# Altium project Test_Jig_Project.PrjPcb
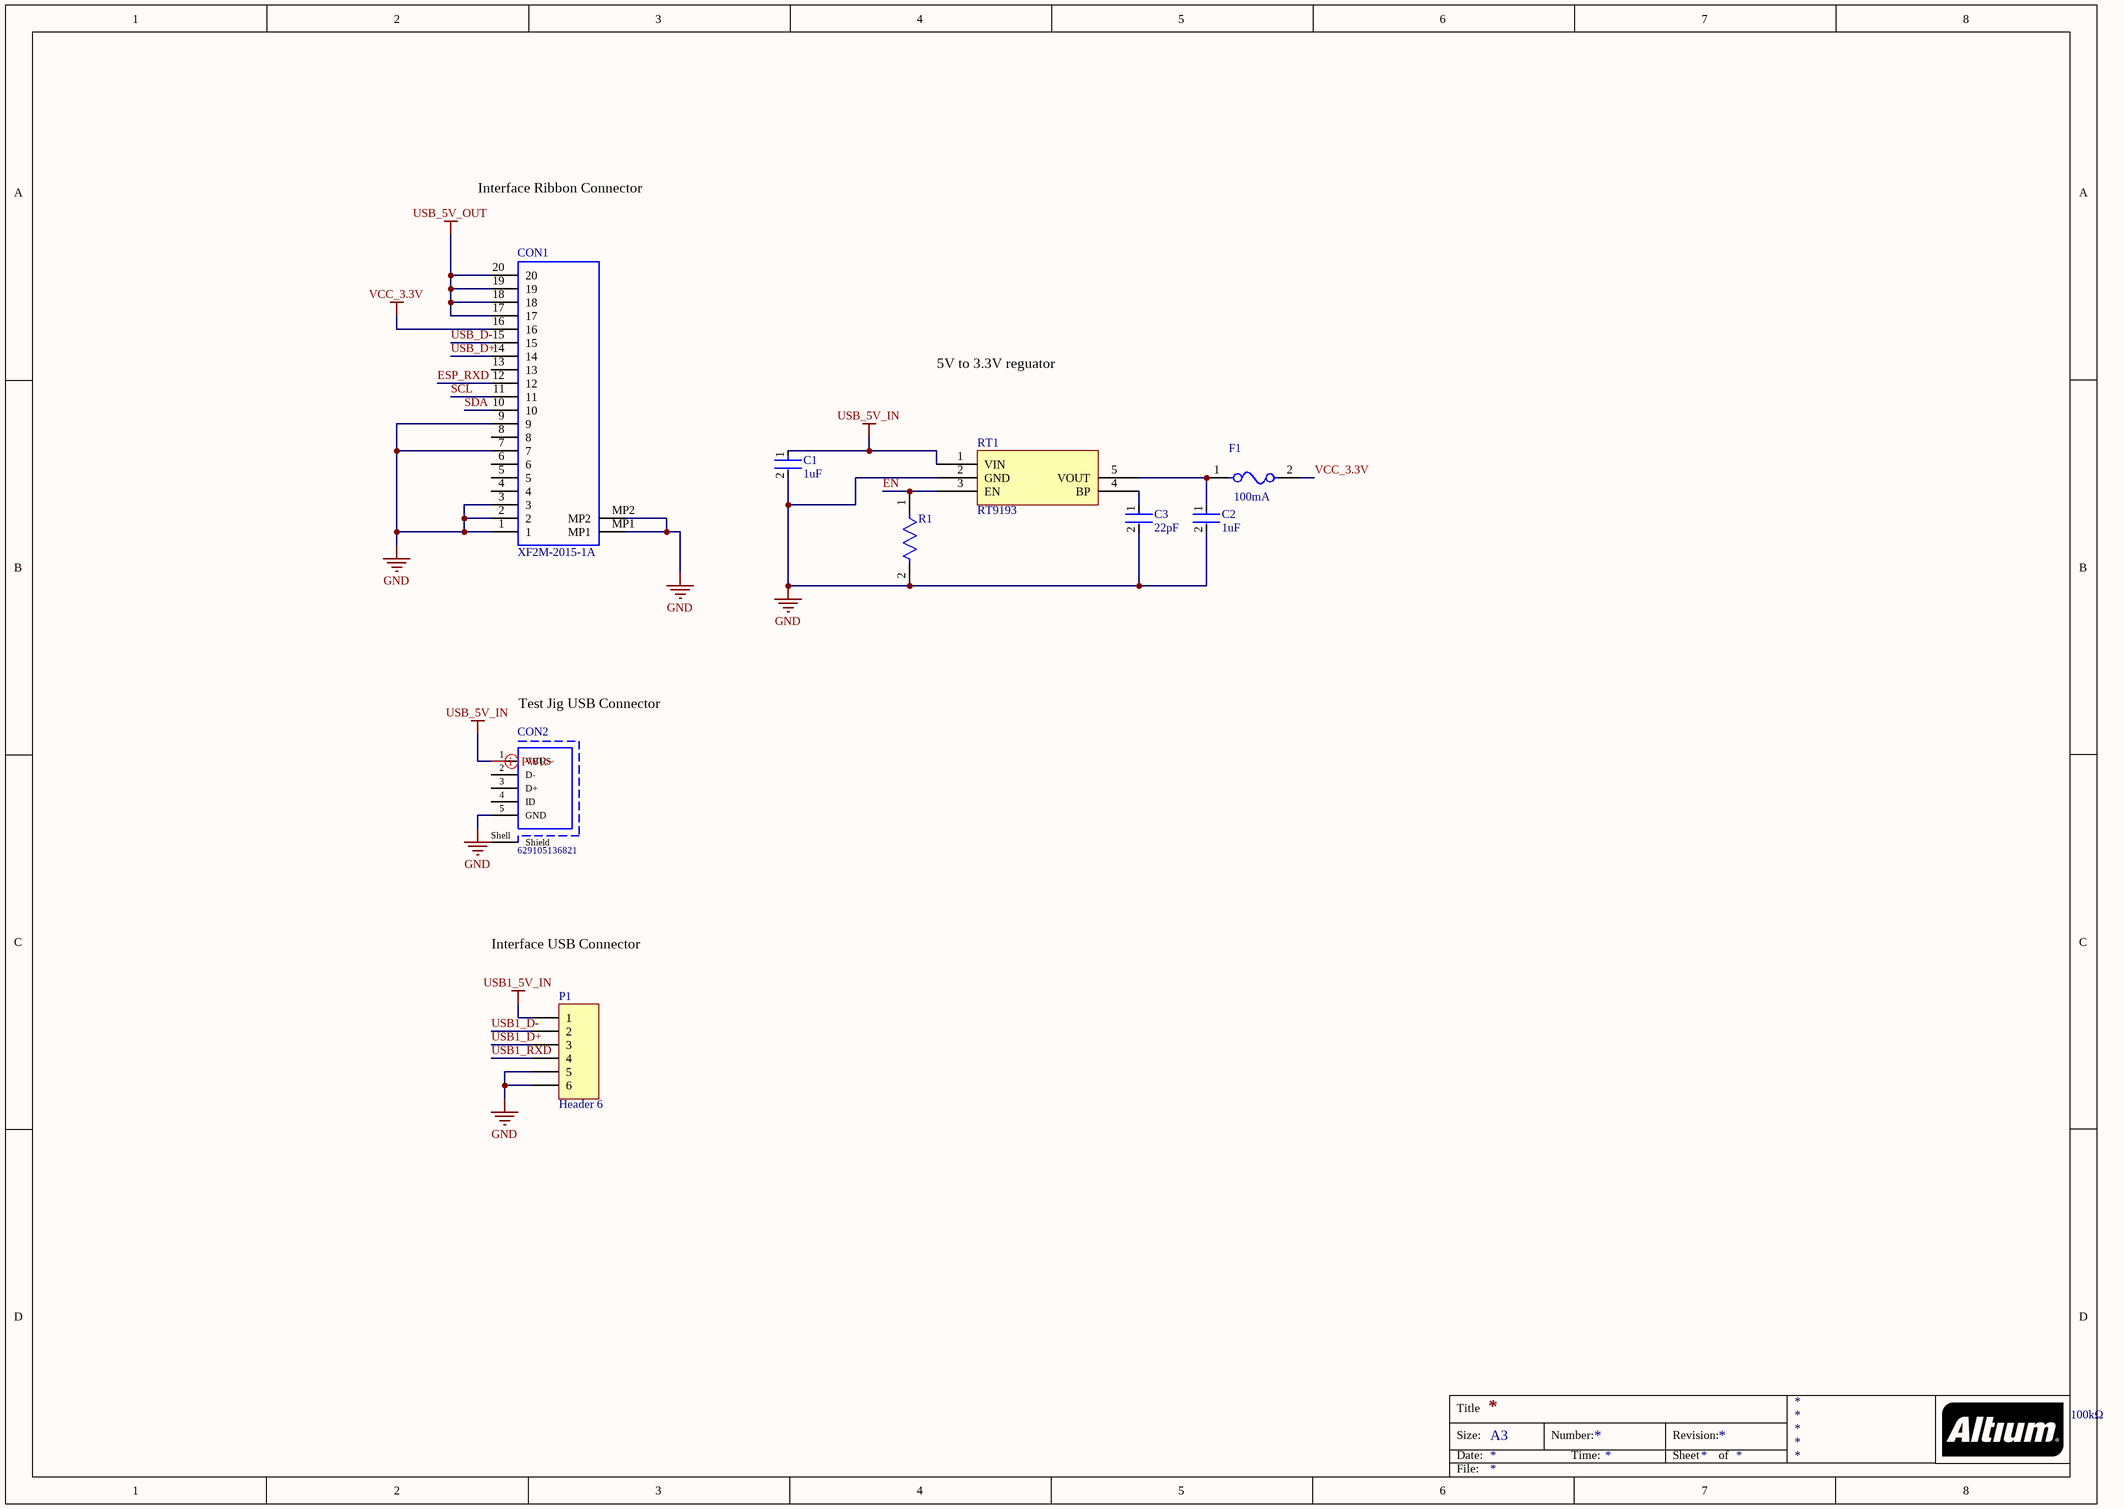
[diagram p0: Test_Jig_Project.SchDoc]
3 sheets, 47 parts. Net scope: global (net labels, ports and power ports of the same name join across sheets).
Board file: Test_Jig_Project1.PcbDoc
Sheets:
  Test_Jig_Project.SchDoc
  Relay connected.SchDoc
  ESP32.SchDoc

## Sheet Test_Jig_Project.SchDoc
size A3

### Parts
C1  1uF  [FP-CC0805-0_85-MFG]
C2  1uF  [FP-CC0805-0_85-MFG]
C3  22pF  [FP-C0402-BB-MFG]
CON1  XF2M-2015-1A  [XF2M20151A]
CON2  629105136821  [629105136821]
F1  100mA  [FP-MF-PSMF-MFG]
P1  Header 6  [HDR1X6]
R1  100kΩ  [FP-CRCW0402-e3-IPC_C]
RT1  RT9193  [SOT85P279X130-5N]

### Nets
GND: C1.2 C2.2 C3.2 CON1.1 CON1.2 CON1.3 CON1.7 CON1.9 CON1.MP1 CON1.MP2 CON2.5(GND) P1.5 P1.6 R1.2 RT1.2(GND)
USB1_5V_IN: P1.1
USB_5V_IN: C1.1 CON2.1(VBUS) RT1.1(VIN)
USB_5V_OUT: CON1.17 CON1.18 CON1.19 CON1.20
VCC_3.3V: CON1.16 F1.2
EN: R1.1 RT1.3(EN)
ESP_RXD: CON1.12
SCL: CON1.11
SDA: CON1.10
USB1_D+: P1.3
USB1_D-: P1.2
USB1_RXD: P1.4
USB_D+: CON1.14
USB_D-: CON1.15
NetC2_1: C2.1 F1.1 RT1.5(VOUT)
NetC3_1: C3.1 RT1.4(BP)

Not connected (* = marked no-connect by the designer): CON1 4 5 6 8 13; CON2 2(D-) 3(D+) 4(ID) Shell(Shield)

### Layout directives
rule Width Constraint [Pref Width = 12mil    Min Width = 6mil    Max Width = 12mil]: USB_5V_IN

### Notes on the sheet
- Interface Ribbon Connector
- 5V to 3.3V reguator
- (near CON2) Test Jig USB Connector
- Interface USB Connector
- Manufacturer
- Title
- Size:
- Date:
- A3
- Number:
- Time:
- Revision:
- Sheet
- of
- File:

### Library data of the parts
C1 C2 = CMP-03422-000182-1: CAP CER 1UF 10V X7R 0805; Manufacturer: Yageo; Mfr. Part #: CC0805KKX7R6BB105; Material: Ceramic; Tolerance: 0.1; Value: 1 uF; ComponentLink2URL: http://www.yageo.com/documents/recent/UPY-GPHC_Y5V_6.3V-to-50V_8.pdf; Automotive: No; Temperature Range Low: -30°C; Octopart: https://octopart.com/cc0805kkx7r6bb105-yageo-42522859; Temperature Characteristic: X7R; RoHS: TRUE; Voltage Rating: 10 V; Capacitance: 1 uF; Package: CC0805-0.85; Device Class L3: Ceramic Capacitors; Category: Cap; Mouser Description: Multilayer Ceramic Capacitors MLCC - SMD/SMT 1.0uF 10V X7R 10%; Temperature Range High: +85°C; Ipc Land Pattern Name: CAPC200125X85; ComponentLink2Description: Datasheet; Temperature: -30°C to +85°C; Height: 0.95mm; Lead Free: Yes; Device Class L1: Passive Components; Device Class L2: Capacitors; Footprint Url: http://www.yageo.com/exep/pages/download/literatures/UPY-C_GEN_24.pdf; Digikey Description: CAP CER 1UF 10V X7R 0805
C3 = CMP-1034-00897-3: CAP CER 22PF 10V NP0 0402; Mfr. Part #: C0402C220K8GACTU; Manufacturer: Kemet; Temperature Coefficient: 15%; Tolerance: 0.1; Temperature Characteristic: C0G; Material: Ceramic; Ipc Land Pattern Name: CAPC10050X50; Mouser Description: Multilayer Ceramic Capacitors MLCC - SMD/SMT 10volts 22pF C0G 10%; Temperature Range High: +125°C; Voltage Rating: 10 V; ComponentLink2Description: Datasheet; Digikey Description: CAP CER 22PF 10V NP0 0402; Device Class L1: Passive Components; Category: Cap; Temperature: -55°C to +125°C; Temperature Range Low: -55°C; ComponentLink2URL: https://content.kemet.com/datasheets/KEM_C1002_X7R_SMD.pdf; Automotive: No; Package: C0402-BB; RoHS: TRUE; Device Class L3: Ceramic Capacitors; Value: 22 pF; Height: 0.55mm; Octopart: https://octopart.com/c0402c220k8gactu-kemet-12592189; Capacitance: 22 pF; Lead Free: Yes; Device Class L2: Capacitors
CON1 = XF2M-2015-1A: OMRON - XF2M-2015-1A - FFC / FPC Board Connector, 0.5 mm, 20 Contacts, Receptacle, XF Series, Surface Mount, Top, Bottom; Manufacturer: Omron Electronics; Geometry.Height: 3.2mm; Mfr. Part #: XF2M-2015-1A; Mouser Part Number: 653-XF2M-2015-1A; Mouser Price/Stock: https://www.mouser.co.uk/ProductDetail/Omron-Electronics/XF2M-2015-1A?qs=9iNEzSI19qWZ677VhkompQ%3D%3D; Arrow Part Number: *; Unit Price: US$ 0.4815; Datasheet Link: https://datasheet.lcsc.com/lcsc/1912111437_Omron-Electronics-XF2M-2015-1A_C57541.pdf
CON2 = CMP-1502-03253-1: Micro USB 2.0 Type B Receptacle WR-COM, Horizontal, SMT, with Pads and Pegs; Manufacturer: Wurth Elektronik; Mfr. Part #: 629105150521; Contact Resistance: 30mOhm; Rated Current: 1A; Working Voltage: 30VAC; Datasheet URL: https://katalog.we-online.de/em/datasheet/629105136821.pdf; Mounting Technology: SMT; Publisher: WurthElektronik; Package Reference: 629105136821; Orientation: Horizontal; Packaging: TapeandReel; Manufacturer URL: http://www.we-online.de; Connector Type: MicroUSB2.0TypeB; Gender: Receptacle; Operating Temperature: -40to105degC
F1 = CMP-07400-000017-1: PTC RESET FUSE 15V 100MA 0805; Mfr. Part #: MF-PSMF010X-2; Manufacturer: Bourns Inc.; Resistance: 1-7.5Ω; Value: 1-7.5Ω; Current Rating: 40A; Hold Current: 0.1A; Trip Current: 0.3A; Trip Time: 1.5s; Temperature: -40°C to +85°C; ComponentLink2Description: Datasheet; Lead Free: Yes; Ipc Land Pattern Name: CAPC215135X67; Device Class L1: Circuit Protection; Mouser Description: Resettable Fuses - PPTC 0.10A 15V 1ohm; Automotive: No; Octopart: https://octopart.com/mf-psmf010x-2-bourns-7483441; RoHS: TRUE; Temperature Range High: +85°C; Digikey Description: PTC RESET FUSE 15V 100MA 0805; Device Class L3: unset; ComponentLink2URL: https://www.bourns.com/docs/Product-Datasheets/mfpsmf.pdf; Height: 0.85mm; Voltage Rating: 15V; Ambient Temperature Range Low: -40°C; Category: Fuse; Package: MF-PSMF; Temperature Range Low: -40°C; Device Class L2: PTC Resettable Fuses; Ambient Temperature Range High: +85°C
P1 = Header 6: Header, 6-Pin; LatestRevisionDate: 17-Jul-2002; LatestRevisionNote: Re-released for DXP Platform.; Publisher: Altium Limited
R1 = CMP-2002-08123-3: RES Thick Film, 100kΩ, 1%, 0.063W, 100ppm/°C, 0402; Manufacturer: Stackpole Electronics; Mfr. Part #: RMCF0402FT100K; Power Rating: 63mW; Resistance: 100kR; Voltage Rating (DC): 50V; Lead Free: Lead Free; Height: 0.35mm; Contact Plating: Tin; Min Operating Temperature: -55°C; Package Quantity: 10000; Case/Package: 0402; Temperature Coefficient: 100ppm/°C; Number of Terminations: 2; Packaging: Tape and Reel; Max Power Dissipation: 63mW; Case Code (Metric): 1005; Mount: Surface Mount; Width: 0.02inch; Termination: SMD/SMT; Length: 1mm; Number of Pins: 2; Weight: 2.3E-05oz; Radiation Hardening: No; Tolerance: 1%; Military Standard: Not; Features: Automotive AEC-Q200; Depth: 0.5mm; Composition: Thick Film; Max Operating Temperature: 155°C; Voltage Rating: 50V; Case Code (Imperial): 0402
RT1 = Component_1: 300mA 70dB@(100Hz),50dB@(10kHz) 300mV@(300mA) Fixed 3.3V~3.3V Positive 1 5.5V SOT-23-5 Linear Voltage Regulators (LDO) ROHS; Manufacturer: Richtek Tech; Mfr. Part #: RT9193-33GB

## Sheet Relay connected.SchDoc
size A2
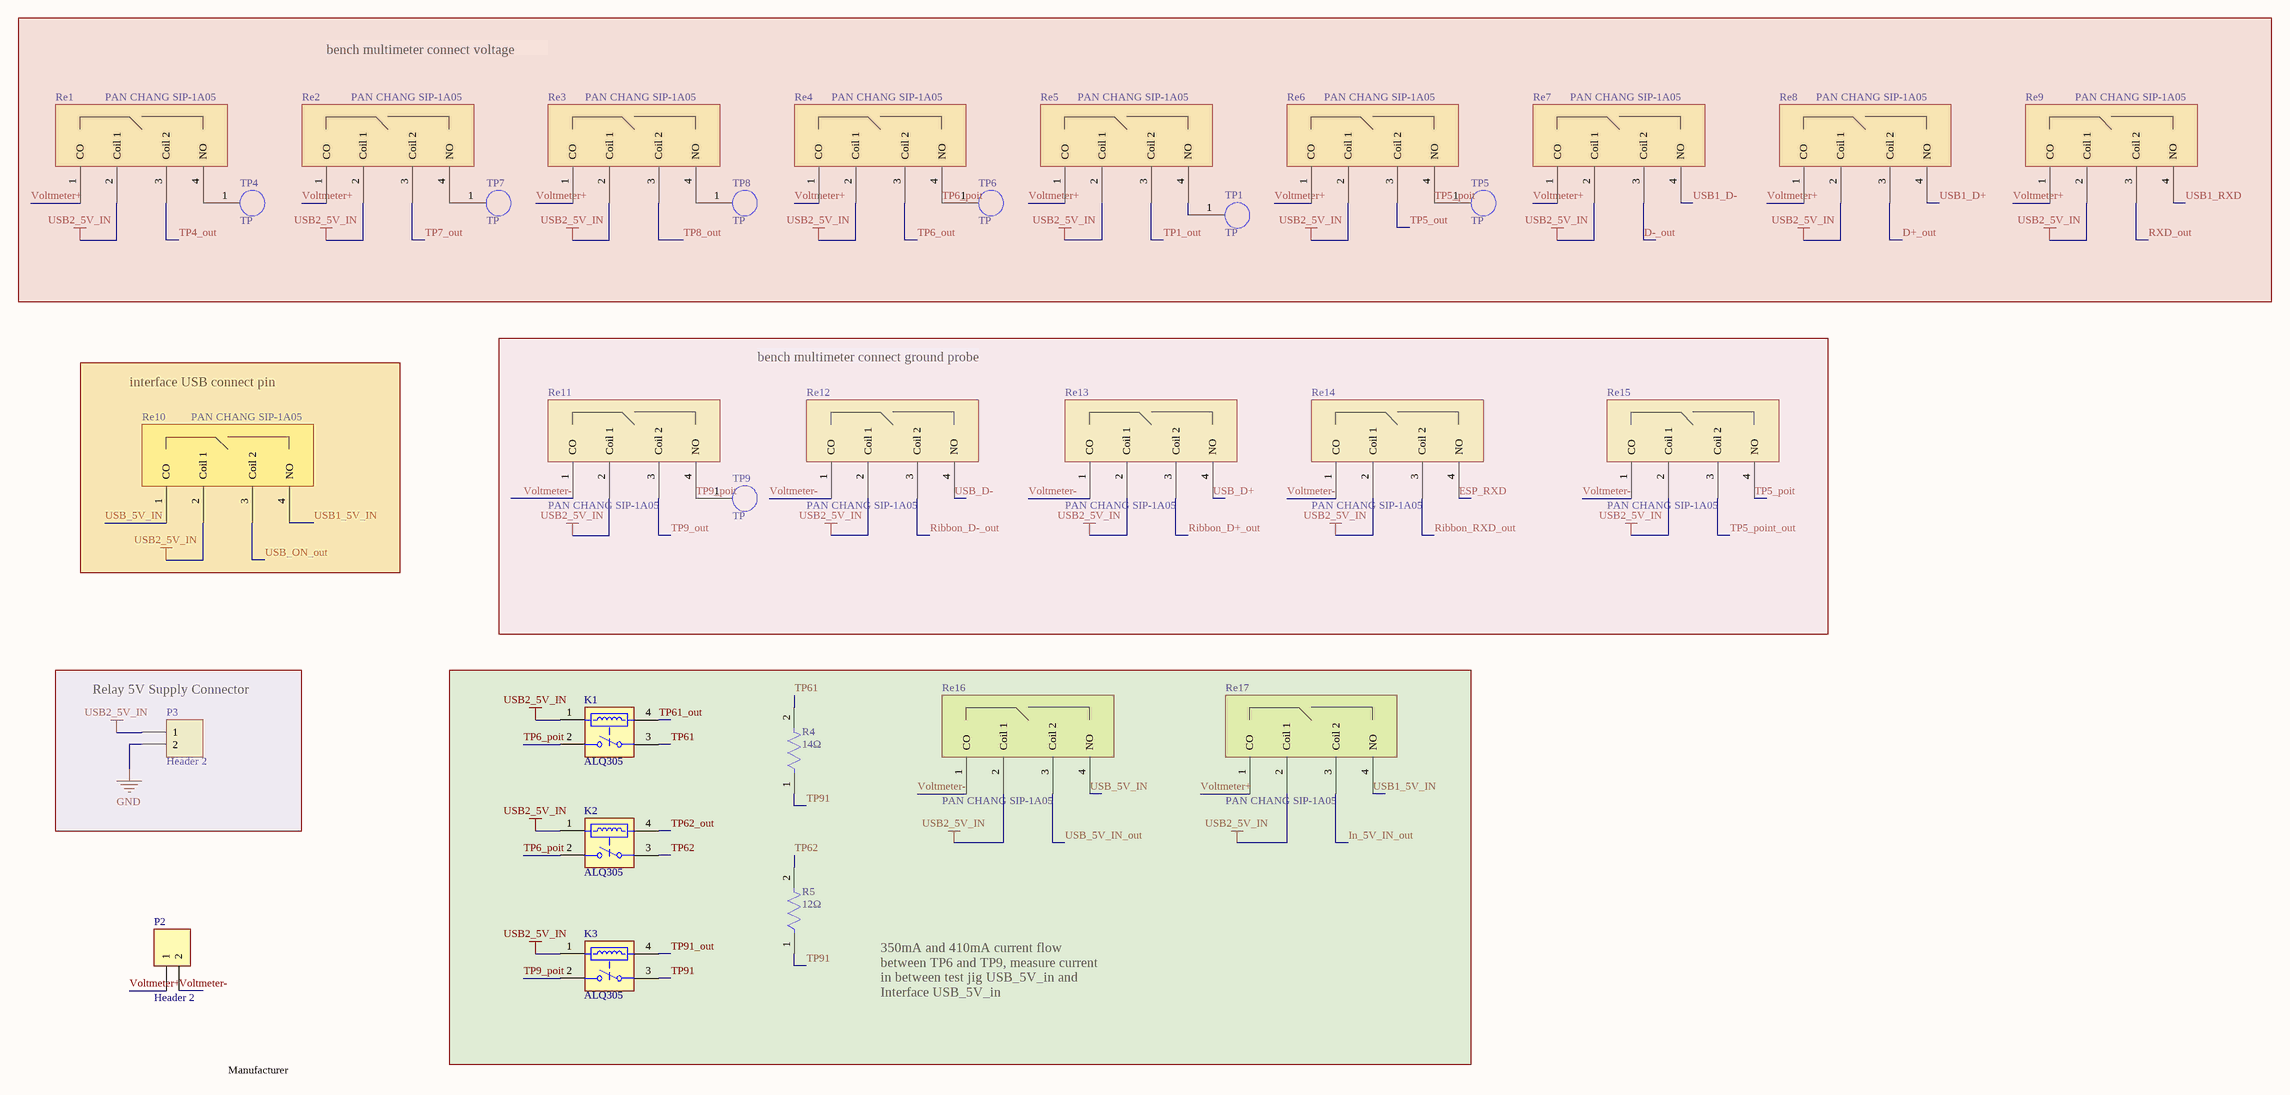
[diagram p1: Relay connected.SchDoc]

### Parts
K1  ALQ305  [PNSC-LQ-4-2000x1000x1600_V]
K2  ALQ305  [PNSC-LQ-4-2000x1000x1600_V]
K3  ALQ305  [PNSC-LQ-4-2000x1000x1600_V]
P2  Header 2  [HDR1X2]
P3  Header 2  [HDR1X2]
R4  14Ω  [FP-CRCW0603-e3-IPC_B]
R5  12Ω  [FP-CRCW0805-e3-IPC_C]
Re1  PAN CHANG SIP-1A05  [PAN CHANG SIP-1A05]
Re2  PAN CHANG SIP-1A05  [PAN CHANG SIP-1A05]
Re3  PAN CHANG SIP-1A05  [PAN CHANG SIP-1A05]
Re4  PAN CHANG SIP-1A05  [PAN CHANG SIP-1A05]
Re5  PAN CHANG SIP-1A05  [PAN CHANG SIP-1A05]
Re6  PAN CHANG SIP-1A05  [PAN CHANG SIP-1A05]
Re7  PAN CHANG SIP-1A05  [PAN CHANG SIP-1A05]
Re8  PAN CHANG SIP-1A05  [PAN CHANG SIP-1A05]
Re9  PAN CHANG SIP-1A05  [PAN CHANG SIP-1A05]
Re10  PAN CHANG SIP-1A05  [PAN CHANG SIP-1A05]
Re11  PAN CHANG SIP-1A05  [PAN CHANG SIP-1A05]
Re12  PAN CHANG SIP-1A05  [PAN CHANG SIP-1A05]
Re13  PAN CHANG SIP-1A05  [PAN CHANG SIP-1A05]
Re14  PAN CHANG SIP-1A05  [PAN CHANG SIP-1A05]
Re15  PAN CHANG SIP-1A05  [PAN CHANG SIP-1A05]
Re16  PAN CHANG SIP-1A05  [PAN CHANG SIP-1A05]
Re17  PAN CHANG SIP-1A05  [PAN CHANG SIP-1A05]
TP1  TP  [Testpoint]  (net tie, no BOM)
TP4  TP  [Testpoint]  (net tie, no BOM)
TP5  TP  [Testpoint]  (net tie, no BOM)
TP6  TP  [Testpoint]  (net tie, no BOM)
TP7  TP  [Testpoint]  (net tie, no BOM)
TP8  TP  [Testpoint]  (net tie, no BOM)
TP9  TP  [Testpoint]  (net tie, no BOM)

### Nets
GND: P3.2
USB1_5V_IN: Re10.4(NO) Re17.4(NO)
USB2_5V_IN: K1.1 K2.1 K3.1 P3.1 Re1.2(Coil_1) Re2.2(Coil_1) Re3.2(Coil_1) Re4.2(Coil_1) Re5.2(Coil_1) Re6.2(Coil_1) Re7.2(Coil_1) Re8.2(Coil_1) Re9.2(Coil_1) Re10.2(Coil_1) Re11.2(Coil_1) Re12.2(Coil_1) Re13.2(Coil_1) Re14.2(Coil_1) Re15.2(Coil_1) Re16.2(Coil_1) Re17.2(Coil_1)
USB_5V_IN: Re10.1(CO) Re16.4(NO)
D+_out: Re8.3(Coil_2)
D-_out: Re7.3(Coil_2)
ESP_RXD: Re14.4(NO)
In_5V_IN_out: Re17.3(Coil_2)
Ribbon_D+_out: Re13.3(Coil_2)
Ribbon_D-_out: Re12.3(Coil_2)
Ribbon_RXD_out: Re14.3(Coil_2)
RXD_out: Re9.3(Coil_2)
TP1_out: Re5.3(Coil_2)
TP4_out: Re1.3(Coil_2)
TP5_out: Re6.3(Coil_2)
TP5_point_out: Re15.3(Coil_2)
TP5_poit: Re6.4(NO) Re15.4(NO) TP5.1
TP6_out: Re4.3(Coil_2)
TP6_poit: K1.2(NO) K2.2(NO) Re4.4(NO) TP6.1
TP7_out: Re2.3(Coil_2)
TP8_out: Re3.3(Coil_2)
TP9_out: Re11.3(Coil_2)
TP9_poit: K3.2(NO) Re11.4(NO) TP9.1
TP61: K1.3(COM) R4.2
TP61_out: K1.4
TP62: K2.3(COM) R5.2
TP62_out: K2.4
TP91: K3.3(COM) R4.1 R5.1
TP91_out: K3.4
USB1_D+: Re8.4(NO)
USB1_D-: Re7.4(NO)
USB1_RXD: Re9.4(NO)
USB_5V_IN_out: Re16.3(Coil_2)
USB_D+: Re13.4(NO)
USB_D-: Re12.4(NO)
USB_ON_out: Re10.3(Coil_2)
Voltmeter+: P2.1 Re1.1(CO) Re2.1(CO) Re3.1(CO) Re4.1(CO) Re5.1(CO) Re6.1(CO) Re7.1(CO) Re8.1(CO) Re9.1(CO) Re17.1(CO)
Voltmeter-: P2.2 Re11.1(CO) Re12.1(CO) Re13.1(CO) Re14.1(CO) Re15.1(CO) Re16.1(CO)
NetRe1_4: Re1.4(NO) TP4.1
NetRe2_4: Re2.4(NO) TP7.1
NetRe3_4: Re3.4(NO) TP8.1
NetRe5_4: Re5.4(NO) TP1.1

### Notes on the sheet
- bench multimeter connect voltage probe
- interface USB connect pin
- bench multimeter connect ground probe
- (near P3) Relay 5V Supply Connector
- 350mA and 410mA current flow between TP6 and TP9, measure current in between test jig USB_5V_in and Interface USB_5V_in
- Manufacturer
- Title
- Size:
- Date:
- File:
- A2
- Number:
- Time:
- Revision:
- Sheet
- of

### Library data of the parts
K1-K3 = CMP-1503-00188-1: LQ Relays, 5 V Coil Voltage, 200 mW Nominal Operating Power, -40 to 85 degC, 4-Pin LQ, Carton, Case, RoHS; Manufacturer: Panasonic; Pb-Free: True; Nominal Operating Power: 200 mW; Max Switching Voltage: 250 V AC; Coil Voltage: 5 V; Max Switching Current: 10 A (N.O.), 3 A (N.C.); Mechanical Life(Min.operation): 1x10^7; Electrical Life: 5x10^4; ComponentLink2URL: http://www3.panasonic.biz/ac/e_download/control/relay/power/catalog/mech_eng_lq.pdf?f_cd=401220; ComponentLink3Description: Package Specification; Mfr. Part #: ALQ305; PackageDescription: 4-Pin Through Hole Terminal Package, Body 20 x 10 mm; Packing: Carton, Case; ComponentLink2Description: Datasheet; ComponentLink1URL: http://www3.panasonic.biz/ac/ae/index.jsp; PackageReference: LQ-4-2000x1000x1600; DatasheetVersion: 201410-T; Mounting Technology: Through Hole; RoHS: True; ComponentLink3URL: http://www3.panasonic.biz/ac/e_download/control/relay/power/catalog/mech_eng_lq.pdf?f_cd=401220; ComponentLink1Description: Manufacturer URL; PackageVersion: ASCTB92E, 10/2014; Series: LQ Relays
P2 P3 = Header 2: Header, 2-Pin; LatestRevisionDate: 17-Jul-2002; LatestRevisionNote: Re-released for DXP Platform.; Publisher: Altium Limited
R4 = CMP-02407-002335-1: RES Thick Film, 14Ω, 1%, 0.1W, 100ppm/°C, 0603; Manufacturer: SEI(Stackpole Elec); Mfr. Part #: RC0603FR-0714RL; Max Power Dissipation: 100mW; Voltage Rating (DC): 75V; Resistance: 14R; Contact Plating: Tin; Radiation Hardening: No; Features: Automotive AEC-Q200; Case Code (Imperial): 0603; Case Code (Metric): 1608; Case/Package: 0603; Lead Free: Lead Free; Max Operating Temperature: 155°C; Package Quantity: 10; Depth: 0.85mm; Weight: 7.1E-05oz; Temperature Coefficient: 100ppm/°C; Width: 0.033inch; Military Standard: Not; Composition: Thick Film; Min Operating Temperature: -55°C; Number of Pins: 2; Voltage Rating: 75V; Length: 1.55mm; Power Rating: 100mW; Number of Terminations: 2; Packaging: Tape and Reel; Height: 0.02inch; Tolerance: 1%
R5 = CMP-1013-00292-2: RES Thick Film, 12Ω, 1%, 0.125W, 100ppm/°C, 0805; Manufacturer: Vishay; Mfr. Part #: CRCW080512R0FKEA; Resistance: 12R; Voltage Rating: 150V; Max Power Dissipation: 125mW; Max Operating Temperature: 155°C; Composition: Thick Film; Case/Package: 0805; Length: 2mm; Features: Automotive AEC-Q200; Termination: SMD/SMT; Width: 0.049inch; Weight: 0.000194oz; Military Standard: Not; Lead Free: Lead Free; Temperature Coefficient: 100ppm/°C; Power Rating: 125mW; Case Code (Imperial): 0805; Number of Terminations: 2; Voltage Rating (DC): 150V; Height: 0.02inch; Depth: 1.25mm; Case Code (Metric): 2012; Packaging: Tape and Reel; Tolerance: 1%; Package Quantity: 10; Min Operating Temperature: -55°C
Re1-Re17 = PAN CHANG SIP-1A05: SPST - NO 5V DC Nolocking Through Hole Reed Relays ROHS; Mfr. Part #: SIP-1A05; LCSC Part #: C10496
  Re16: Manufacturer: PAN CHANG

## Sheet ESP32.SchDoc
size A4
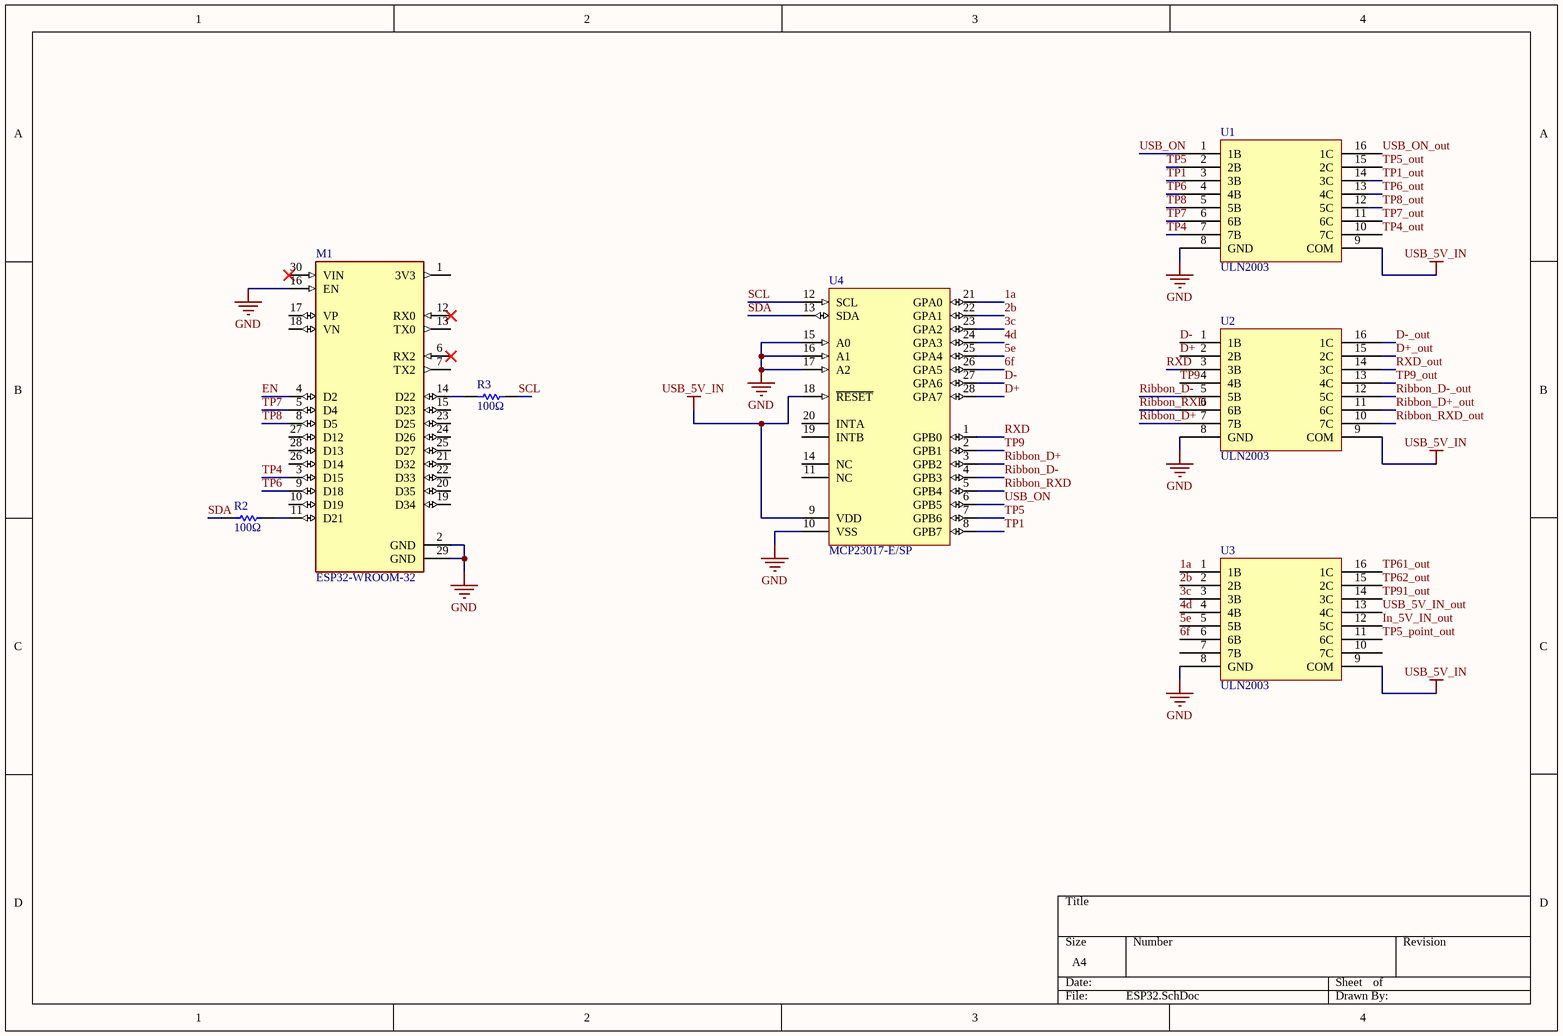
[diagram p2: ESP32.SchDoc]

### Parts
M1  ESP32-WROOM-32  [ESP32-DEVKIT-V1]
R2  100Ω  [RESC2013X60X40ML20T25]
R3  100Ω  [RESC2013X60X40ML20T25]
U1  ULN2003  [SOP127P600X175-16N]
U2  ULN2003  [SOP127P600X175-16N]
U3  ULN2003  [SOP127P600X175-16N]
U4  MCP23017-E/SP  [SPDIP300-SP28]

### Nets
GND: M1.2(GND) M1.16(EN) M1.29(GND) U1.8(GND) U2.8(GND) U3.8(GND) U4.10(VSS) U4.15(A0) U4.16(A1) U4.17(A2)
USB_5V_IN: U1.9(COM) U2.9(COM) U3.9(COM) U4.9(VDD) U4.18(~{RESET})
1a: U3.1(1B) U4.21(GPA0)
2b: U3.2(2B) U4.22(GPA1)
3c: U3.3(3B) U4.23(GPA2)
4d: U3.4(4B) U4.24(GPA3)
5e: U3.5(5B) U4.25(GPA4)
6f: U3.6(6B) U4.26(GPA5)
D+: U2.2(2B) U4.28(GPA7)
D+_out: U2.15(2C)
D-: U2.1(1B) U4.27(GPA6)
D-_out: U2.16(1C)
EN: M1.4(D2)
In_5V_IN_out: U3.12(5C)
Ribbon_D+: U2.7(7B) U4.3(GPB2)
Ribbon_D+_out: U2.11(6C)
Ribbon_D-: U2.5(5B) U4.4(GPB3)
Ribbon_D-_out: U2.12(5C)
Ribbon_RXD: U2.6(6B) U4.5(GPB4)
Ribbon_RXD_out: U2.10(7C)
RXD: U2.3(3B) U4.1(GPB0)
RXD_out: U2.14(3C)
SCL: R3.2 U4.12(SCL)
SDA: R2.1 U4.13(SDA)
TP1: U1.3(3B) U4.8(GPB7)
TP1_out: U1.14(3C)
TP4: M1.3(D15) U1.7(7B)
TP4_out: U1.10(7C)
TP5: U1.2(2B) U4.7(GPB6)
TP5_out: U1.15(2C)
TP5_point_out: U3.11(6C)
TP6: M1.9(D18) U1.4(4B)
TP6_out: U1.13(4C)
TP7: M1.5(D4) U1.6(6B)
TP7_out: U1.11(6C)
TP8: M1.8(D5) U1.5(5B)
TP8_out: U1.12(5C)
TP9: U2.4(4B) U4.2(GPB1)
TP9_out: U2.13(4C)
TP61_out: U3.16(1C)
TP62_out: U3.15(2C)
TP91_out: U3.14(3C)
USB_5V_IN_out: U3.13(4C)
USB_ON: U1.1(1B) U4.6(GPB5)
USB_ON_out: U1.16(1C)
NetM1_11: M1.11(D21) R2.2
NetM1_14: M1.14(D22) R3.1

Not connected (* = marked no-connect by the designer): M1 1(3V3) 6(RX2)* 7(TX2) 10(D19) 12(RX0)* 13(TX0) 15(D23) 17(VP) 18(VN) 19(D34) 20(D35) 21(D32) 22(D33) 23(D25) 24(D26) 25(D27) 26(D14) 27(D12) 28(D13) 30(VIN)*; U3 7(7B) 10(7C); U4 11(NC) 14(NC) 19(INTB) 20(INTA)

### Library data of the parts
M1 = ESP32-DEVKIT-V1: Dual core, Wi-Fi: 2.4 GHz up to 150 Mbits/s,BLE (Bluetooth Low Energy) and legacy Bluetooth, 32 bits, Up to 240 MHz
R2 R3 = CMP-2001-00580-1: Res Thin Film 0805 100 Ohm 0.1% 1/8W ±25ppm/°C Molded SMD SMD Punched Carrier T/R; Manufacturer: Panasonic; Mfr. Part #: ERA6AEB101V
U1 = Component_1: SOP-16 Darlington Transistor Arrays ROHS; Manufacturer: Changjiang Electronics Tech; Mfr. Part #: ULN2003; Datasheet: https://datasheet.lcsc.com/lcsc/2108201930_Changjiang-Electronics-Tech--CJ-ULN2003_C2829422.pdf; Package: SOP-16; Unit Price: $ 0.2329
U2 U3 = Component_1: Manufacturer: Changjiang Electronics Tech; Mfr. Part #: ULN2003; Datasheet: https://datasheet.lcsc.com/lcsc/2108201930_Changjiang-Electronics-Tech--CJ-ULN2003_C2829422.pdf; Package: SOP-16; Unit Price: $ 0.2329
U4 = CMP-0186-00081-2: 16-Bit I/O Expander with Serial Interface, 28-Pin SPDIP, Extended Temperature; Manufacturer: Microchip Tech; RevisionNote: URLs added.; ComponentLink3Description: Package Specification; PackageVersion: revBB, Aug-2009; ComponentLink1Description: Manufacturer URL; DatasheetVersion: revB, Feb-2007; PackageDescription: 28-Lead Skinny Plastic Dual In-Line (SP) - 300 mil Body [SPDIP]; ComponentLink1URL: http://www.microchip.com/; PackageReference: SPDIP300-SP28; ComponentLink3URL: http://www.microchip.com/stellent/groups/techpub_sg/documents/packagingspec/en012702.pdf; ComponentLink2Description: Datasheet; ComponentLink2URL: http://ww1.microchip.com/downloads/en/DeviceDoc/21952b.pdf; Mfr. Part #: MCP23017-E/SP

## Nets that join several sheets
GND: Test_Jig_Project (15 pins), Relay connected (P3.2), ESP32 (10 pins)
USB1_5V_IN: Test_Jig_Project (P1.1), Relay connected (Re10.4 Re17.4)
USB_5V_IN: Test_Jig_Project (C1.1 CON2.1 RT1.1), Relay connected (Re10.1 Re16.4), ESP32 (5 pins)
D+_out: Relay connected (Re8.3), ESP32 (U2.15)
D-_out: Relay connected (Re7.3), ESP32 (U2.16)
EN: Test_Jig_Project (R1.1 RT1.3), ESP32 (M1.4)
ESP_RXD: Test_Jig_Project (CON1.12), Relay connected (Re14.4)
In_5V_IN_out: Relay connected (Re17.3), ESP32 (U3.12)
Ribbon_D+_out: Relay connected (Re13.3), ESP32 (U2.11)
Ribbon_D-_out: Relay connected (Re12.3), ESP32 (U2.12)
Ribbon_RXD_out: Relay connected (Re14.3), ESP32 (U2.10)
RXD_out: Relay connected (Re9.3), ESP32 (U2.14)
SCL: Test_Jig_Project (CON1.11), ESP32 (R3.2 U4.12)
SDA: Test_Jig_Project (CON1.10), ESP32 (R2.1 U4.13)
TP1_out: Relay connected (Re5.3), ESP32 (U1.14)
TP4_out: Relay connected (Re1.3), ESP32 (U1.10)
TP5_out: Relay connected (Re6.3), ESP32 (U1.15)
TP5_point_out: Relay connected (Re15.3), ESP32 (U3.11)
TP6_out: Relay connected (Re4.3), ESP32 (U1.13)
TP7_out: Relay connected (Re2.3), ESP32 (U1.11)
TP8_out: Relay connected (Re3.3), ESP32 (U1.12)
TP9_out: Relay connected (Re11.3), ESP32 (U2.13)
TP61_out: Relay connected (K1.4), ESP32 (U3.16)
TP62_out: Relay connected (K2.4), ESP32 (U3.15)
TP91_out: Relay connected (K3.4), ESP32 (U3.14)
USB1_D+: Test_Jig_Project (P1.3), Relay connected (Re8.4)
USB1_D-: Test_Jig_Project (P1.2), Relay connected (Re7.4)
USB1_RXD: Test_Jig_Project (P1.4), Relay connected (Re9.4)
USB_5V_IN_out: Relay connected (Re16.3), ESP32 (U3.13)
USB_D+: Test_Jig_Project (CON1.14), Relay connected (Re13.4)
USB_D-: Test_Jig_Project (CON1.15), Relay connected (Re12.4)
USB_ON_out: Relay connected (Re10.3), ESP32 (U1.16)